# EAGLE design RPi GPIO Expander (EAGLE 9.5.2)
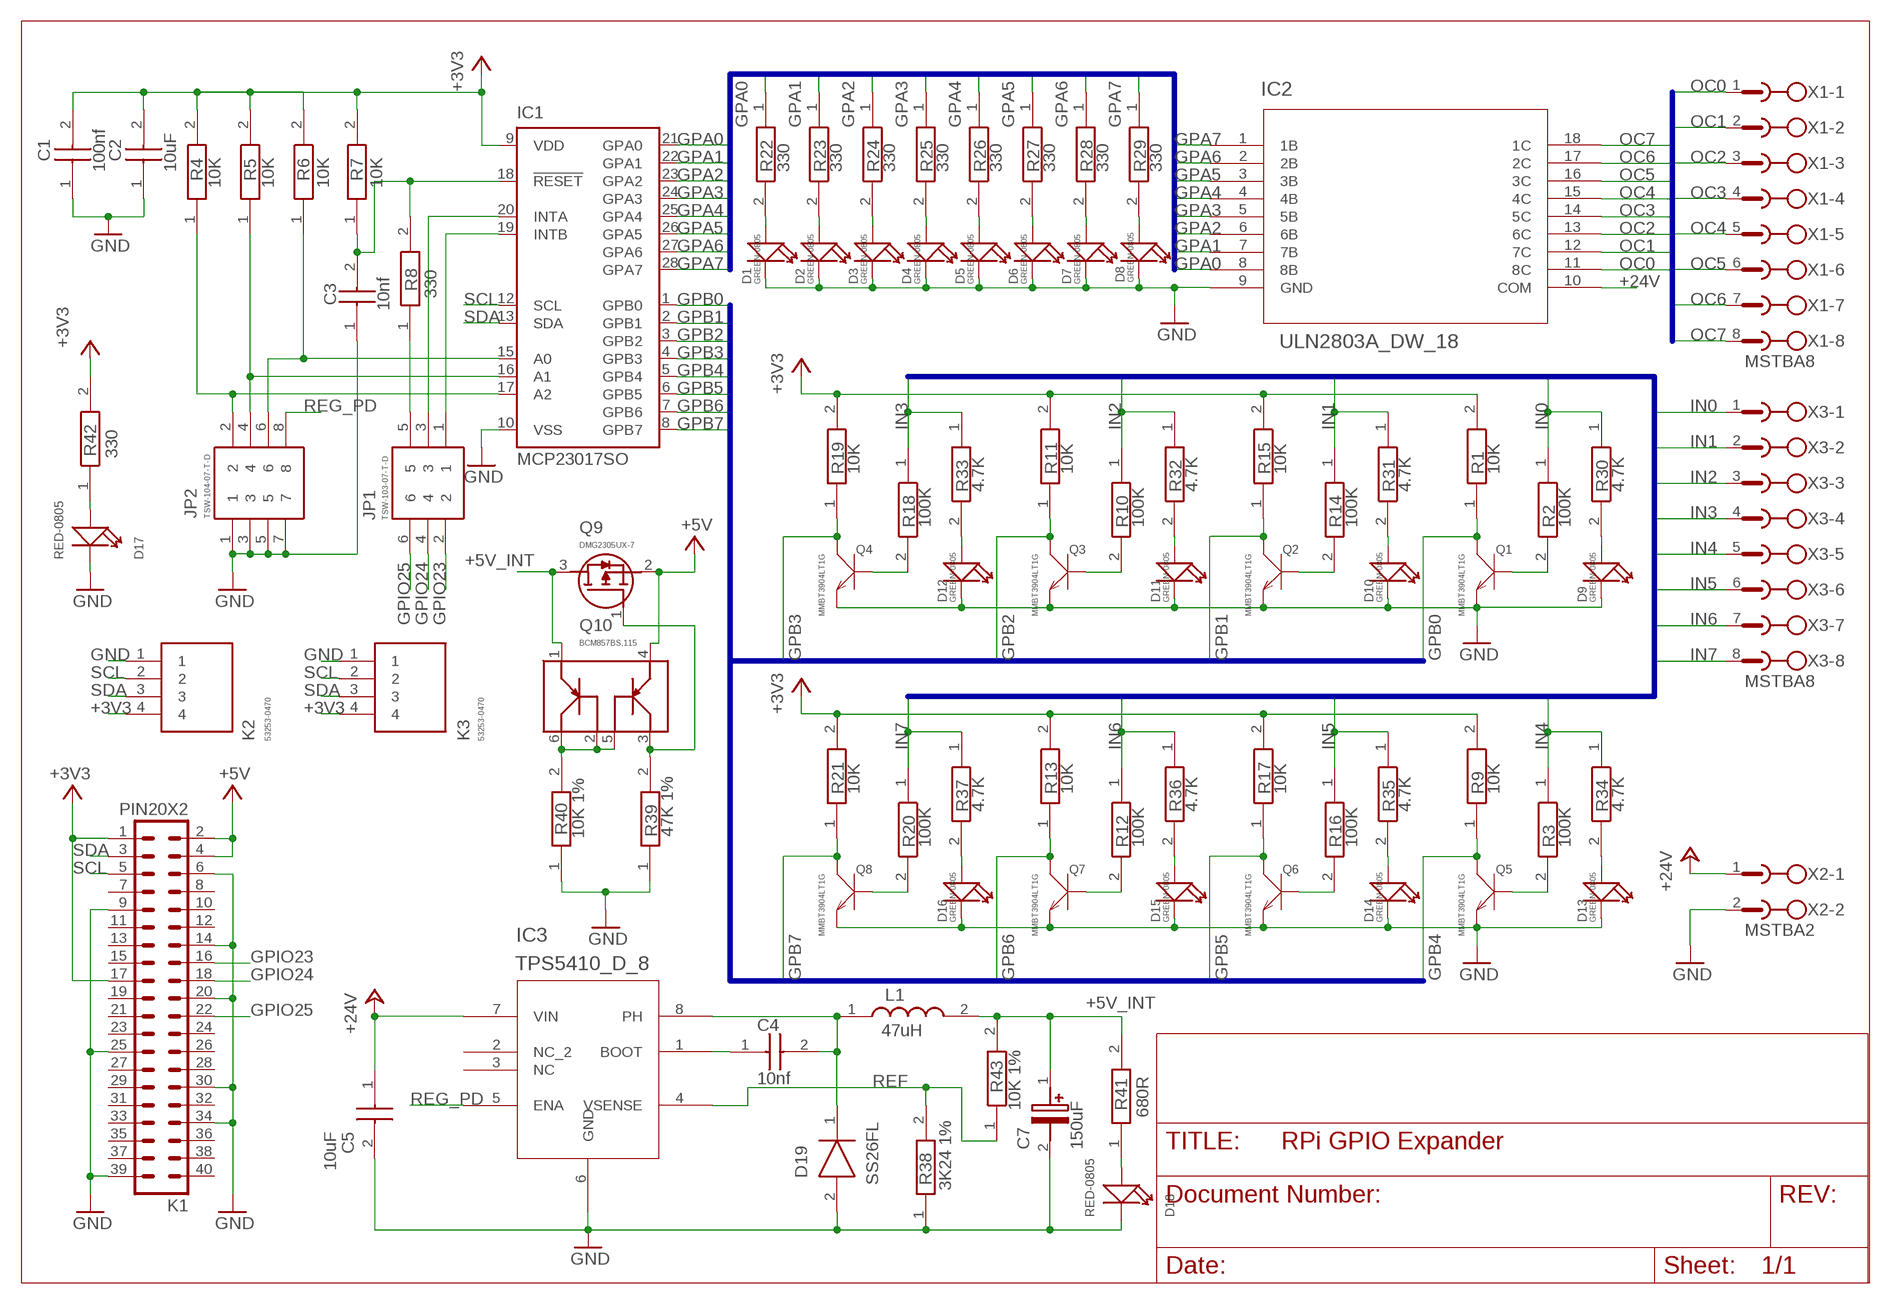
[diagram p0: schematic, sheet 1]

## Parts
C1  100nf  CC0805KRX7R9BB104  [CAPC2012X95N]
C2  10uF  CC0805ZKY5V6BB106  [CAPC2013X145N]
C3  10nf  CC0805KRX7R9BB103  [CAPC2012X135N]
C4  10nf  CC0805KRX7R9BB103  [CAPC2012X135N]
C5  10uF  C3225X7R1H106M250AC  [CAPC3225X230N]
C7  150uF  6TPG150M  [CAPPM3629X150N]
D1  GREEN-0805  SMD-LED-CLEAR-GREEN(0805)  [LED-0805]
D2  GREEN-0805  SMD-LED-CLEAR-GREEN(0805)  [LED-0805]
D3  GREEN-0805  SMD-LED-CLEAR-GREEN(0805)  [LED-0805]
D4  GREEN-0805  SMD-LED-CLEAR-GREEN(0805)  [LED-0805]
D5  GREEN-0805  SMD-LED-CLEAR-GREEN(0805)  [LED-0805]
D6  GREEN-0805  SMD-LED-CLEAR-GREEN(0805)  [LED-0805]
D7  GREEN-0805  SMD-LED-CLEAR-GREEN(0805)  [LED-0805]
D8  GREEN-0805  SMD-LED-CLEAR-GREEN(0805)  [LED-0805]
D9  GREEN-0805  SMD-LED-CLEAR-GREEN(0805)  [LED-0805]
D10  GREEN-0805  SMD-LED-CLEAR-GREEN(0805)  [LED-0805]
D11  GREEN-0805  SMD-LED-CLEAR-GREEN(0805)  [LED-0805]
D12  GREEN-0805  SMD-LED-CLEAR-GREEN(0805)  [LED-0805]
D13  GREEN-0805  SMD-LED-CLEAR-GREEN(0805)  [LED-0805]
D14  GREEN-0805  SMD-LED-CLEAR-GREEN(0805)  [LED-0805]
D15  GREEN-0805  SMD-LED-CLEAR-GREEN(0805)  [LED-0805]
D16  GREEN-0805  SMD-LED-CLEAR-GREEN(0805)  [LED-0805]
D17  RED-0805  SMD-LED-CLEAR-RED(0805)  [LED-0805]
D18  RED-0805  SMD-LED-CLEAR-RED(0805)  [LED-0805]
D19  SS26FL  [SODFL3617X108N]
IC1  MCP23017SO  [SO28W]
IC2  ULN2803A_DW_18  [DW18]
IC3  TPS5410_D_8  [D8]
JP1  TSW-103-07-T-D  [HDRV6W64P254_2X3_762X495X838P]
JP2  TSW-104-07-T-D  [HDRV8W64P254_2X4_1016X495X838P]
K1  PIN20X2  [PIN_20X2]
K2  53253-0470  [SHDR4W50P0X200_1X4_1000X365X55]
K3  53253-0470  [SHDR4W50P0X200_1X4_1000X365X55]
L1  47uH  CLF10060NIT-470M-D  [INDPM101100X630N]
Q1  MMBT3904LT1G  SMD-TRANSISTORS-NPN-40V-200MA-MMBT3904LT1G(SOT-23)  [SOT-23]
Q2  MMBT3904LT1G  SMD-TRANSISTORS-NPN-40V-200MA-MMBT3904LT1G(SOT-23)  [SOT-23]
Q3  MMBT3904LT1G  SMD-TRANSISTORS-NPN-40V-200MA-MMBT3904LT1G(SOT-23)  [SOT-23]
Q4  MMBT3904LT1G  SMD-TRANSISTORS-NPN-40V-200MA-MMBT3904LT1G(SOT-23)  [SOT-23]
Q5  MMBT3904LT1G  SMD-TRANSISTORS-NPN-40V-200MA-MMBT3904LT1G(SOT-23)  [SOT-23]
Q6  MMBT3904LT1G  SMD-TRANSISTORS-NPN-40V-200MA-MMBT3904LT1G(SOT-23)  [SOT-23]
Q7  MMBT3904LT1G  SMD-TRANSISTORS-NPN-40V-200MA-MMBT3904LT1G(SOT-23)  [SOT-23]
Q8  MMBT3904LT1G  SMD-TRANSISTORS-NPN-40V-200MA-MMBT3904LT1G(SOT-23)  [SOT-23]
Q9  DMG2305UX-7  [SOT96P240X100-3N]
Q10  BCM857BS,115  [SOT65P210X110-6N]
R1  10K  RC0805JR-0710KL  [RESC2012X60N]
R2  100K  RC0805JR-07100KL  [RESC2012X60N]
R3  100K  RC0805JR-07100KL  [RESC2012X60N]
R4  10K  RC0805JR-0710KL  [RESC2012X60N]
R5  10K  RC0805JR-0710KL  [RESC2012X60N]
R6  10K  RC0805JR-0710KL  [RESC2012X60N]
R7  10K  RC0805JR-0710KL  [RESC2012X60N]
R8  330  RC0805JR-07330RL  [RESC2012X60N]
R9  10K  RC0805JR-0710KL  [RESC2012X60N]
R10  100K  RC0805JR-07100KL  [RESC2012X60N]
R11  10K  RC0805JR-0710KL  [RESC2012X60N]
R12  100K  RC0805JR-07100KL  [RESC2012X60N]
R13  10K  RC0805JR-0710KL  [RESC2012X60N]
R14  100K  RC0805JR-07100KL  [RESC2012X60N]
R15  10K  RC0805JR-0710KL  [RESC2012X60N]
R16  100K  RC0805JR-07100KL  [RESC2012X60N]
R17  10K  RC0805JR-0710KL  [RESC2012X60N]
R18  100K  RC0805JR-07100KL  [RESC2012X60N]
R19  10K  RC0805JR-0710KL  [RESC2012X60N]
R20  100K  RC0805JR-07100KL  [RESC2012X60N]
R21  10K  RC0805JR-0710KL  [RESC2012X60N]
R22  330  RC0805JR-07330RL  [RESC2012X60N]
R23  330  RC0805JR-07330RL  [RESC2012X60N]
R24  330  RC0805JR-07330RL  [RESC2012X60N]
R25  330  RC0805JR-07330RL  [RESC2012X60N]
R26  330  RC0805JR-07330RL  [RESC2012X60N]
R27  330  RC0805JR-07330RL  [RESC2012X60N]
R28  330  RC0805JR-07330RL  [RESC2012X60N]
R29  330  RC0805JR-07330RL  [RESC2012X60N]
R30  4.7K  RC0805JR-074K7L  [RESC2012X60N]
R31  4.7K  RC0805JR-074K7L  [RESC2012X60N]
R32  4.7K  RC0805JR-074K7L  [RESC2012X60N]
R33  4.7K  RC0805JR-074K7L  [RESC2012X60N]
R34  4.7K  RC0805JR-074K7L  [RESC2012X60N]
R35  4.7K  RC0805JR-074K7L  [RESC2012X60N]
R36  4.7K  RC0805JR-074K7L  [RESC2012X60N]
R37  4.7K  RC0805JR-074K7L  [RESC2012X60N]
R38  3K24 1%  RC0805FR-073K24L  [RESC2012X60N]
R39  47K 1%  RC0805FR-0747KL  [RESC2012X60N]
R40  10K 1%  RC0805FR-0710KL  [RESC2012X60N]
R41  680R  RC0805JR-07680RL  [RESC2012X60N]
R42  330  RC0805JR-07330RL  [RESC2012X60N]
R43  10K 1%  RC0805FR-0710KL  [RESC2012X60N]
X1  MSTBA8  [MSTBA8]
X2  MSTBA2  [MSTBA2]
X3  MSTBA8  [MSTBA8]

## Nets
+3V3: C1.2 C2.2(C2) IC1.9(VDD) K1.1 K1.17 K2.4 K3.4 R1.2 R4.2 R5.2 R6.2 R7.2 R9.2 R11.2 R13.2 R15.2 R17.2 R19.2 R21.2 R42.2
+5V: K1.2 K1.4 Q9.2(S) Q10.4
+5V_INT: C7.1(+) L1.2 Q9.3(D) Q10.1 R41.2 R43.2
+24V: C5.1 IC2.10(COM) IC3.7(VIN) X2.1
GND: C1.1 C2.1(C1) C3.1 C5.2 C7.2(-) D1.- D2.- D3.- D4.- D5.- D6.- D7.- D8.- D9.- D10.- D11.- D12.- D13.- D14.- D15.- D16.- D17.- D18.- D19.2(A) IC1.10(VSS) IC2.9(GND) IC3.6(GND) JP2.1 JP2.3 JP2.5 JP2.7 K1.6 K1.9 K1.14 K1.20 K1.25 K1.30 K1.34 K1.39 K2.1 K3.1 Q1.2(E) Q2.2(E) Q3.2(E) Q4.2(E) Q5.2(E) Q6.2(E) Q7.2(E) Q8.2(E) R38.1 R39.1 R40.1 X2.2
GPA0: IC1.21(GPA0) IC2.8(8B) R22.1
GPA1: IC1.22(GPA1) IC2.7(7B) R23.1
GPA2: IC1.23(GPA2) IC2.6(6B) R24.1
GPA3: IC1.24(GPA3) IC2.5(5B) R25.1
GPA4: IC1.25(GPA4) IC2.4(4B) R26.1
GPA5: IC1.26(GPA5) IC2.3(3B) R27.1
GPA6: IC1.27(GPA6) IC2.2(2B) R28.1
GPA7: IC1.28(GPA7) IC2.1(1B) R29.1
GPB0: IC1.1(GPB0) Q1.3(C) R1.1
GPB1: IC1.2(GPB1) Q2.3(C) R15.1
GPB2: IC1.3(GPB2) Q3.3(C) R11.1
GPB3: IC1.4(GPB3) Q4.3(C) R19.1
GPB4: IC1.5(GPB4) Q5.3(C) R9.1
GPB5: IC1.6(GPB5) Q6.3(C) R17.1
GPB6: IC1.7(GPB6) Q7.3(C) R13.1
GPB7: IC1.8(GPB7) Q8.3(C) R21.1
GPIO23: JP1.2 K1.16
GPIO24: JP1.4 K1.18
GPIO25: JP1.6 K1.22
IN0: R2.1 R30.1 X3.1
IN1: R14.1 R31.1 X3.2
IN2: R10.1 R32.1 X3.3
IN3: R18.1 R33.1 X3.4
IN4: R3.1 R34.1 X3.5
IN5: R16.1 R35.1 X3.6
IN6: R12.1 R36.1 X3.7
IN7: R20.1 R37.1 X3.8
N$1: D12.+ R33.2
N$2: D1.+ R22.2
N$3: Q1.1(B) R2.2
N$4: IC1.19(INTB) JP1.1
N$5: JP1.5 R8.1
N$6: D2.+ R23.2
N$7: D3.+ R24.2
N$8: D4.+ R25.2
N$9: D5.+ R26.2
N$10: D6.+ R27.2
N$11: D7.+ R28.2
N$12: IC1.15(A0) JP2.6 R6.1
N$13: IC1.16(A1) JP2.4 R5.1
N$14: IC1.17(A2) JP2.2 R4.1
N$15: C3.2 IC1.18(!RESET) R7.1 R8.2
N$16: IC1.20(INTA) JP1.3
N$17: D11.+ R32.2
N$18: Q5.1(B) R3.2
N$19: D10.+ R31.2
N$20: Q3.1(B) R10.2
N$21: D9.+ R30.2
N$22: Q7.1(B) R12.2
N$23: D13.+ R34.2
N$24: Q2.1(B) R14.2
N$25: D14.+ R35.2
N$26: Q6.1(B) R16.2
N$27: D15.+ R36.2
N$28: Q4.1(B) R18.2
N$29: D16.+ R37.2
N$30: Q8.1(B) R20.2
N$31: D8.+ R29.2
N$32: Q10.2 Q10.5 Q10.6 R40.2
N$33: C4.2 D19.1(K) IC3.8(PH) L1.1
N$34: D18.+ R41.1
N$35: C4.1 IC3.1(BOOT)
N$36: D17.+ R42.1
N$38: Q9.1(G) Q10.3 R39.2
OC0: IC2.11(8C) X1.1
OC1: IC2.12(7C) X1.2
OC2: IC2.13(6C) X1.3
OC3: IC2.14(5C) X1.4
OC4: IC2.15(4C) X1.5
OC5: IC2.16(3C) X1.6
OC6: IC2.17(2C) X1.7
OC7: IC2.18(1C) X1.8
REF: IC3.4(VSENSE) R38.2 R43.1
REG_PD: IC3.5(ENA) JP2.8
SCL: IC1.12(SCL) K1.5 K2.2 K3.2
SDA: IC1.13(SDA) K1.3 K2.3 K3.3
Unconnected: IC3.2(NC_2) IC3.3(NC) K1.7 K1.8 K1.10 K1.11 K1.12 K1.13 K1.15 K1.19 K1.21 K1.23 K1.24 K1.26 K1.27 K1.28 K1.29 K1.31 K1.32 K1.33 K1.35 K1.36 K1.37 K1.38 K1.40

## Buses
GPA:GPA[0..7]
GPB:GPB[0..7]
IN:IN[0..7]
OC:OC[0..7]

## Library data of the parts
C1 = SamacSys_Parts:CC0805KRX7R9BB104: SURFACE-MOUNT CERAMIC MULTILAYER CAPACITORS Source: Datasheet <https://componentsearchengine.com/Datasheets/1/CC0805KRX7R9BB104.pdf>; DESCRIPTION: SURFACE-MOUNT CERAMIC MULTILAYER CAPACITORS; DIELECTRIC: X7R; HEIGHT: 0.95mm; MANUFACTURER_NAME: YAGEO (PHYCOMP); MANUFACTURER_PART_NUMBER: CC0805KRX7R9BB104; MOUSER_PART_NUMBER: 603-CC805KRX7R9BB104; MOUSER_PRICE-STOCK: https://www.mouser.com/Search/Refine.aspx?Keyword=603-CC805KRX7R9BB104
C2 = SamacSys_Parts:CC0805ZKY5V6BB106: CAPACITOR, 0805 10uF -20% to +80% 10V Source: Datasheet <https://componentsearchengine.com/Datasheets/1/CC0805ZKY5V6BB106.pdf>; DESCRIPTION: CAPACITOR, 0805 10uF -20% to +80% 10V; HEIGHT: mm; MANUFACTURER_NAME: YAGEO (PHYCOMP); MANUFACTURER_PART_NUMBER: CC0805ZKY5V6BB106; MOUSER_PART_NUMBER: 603-CC805ZKY5V6BB106; MOUSER_PRICE-STOCK: https://www.mouser.com/Search/Refine.aspx?Keyword=603-CC805ZKY5V6BB106
C3 C4 = SamacSys_Parts:CC0805KRX7R9BB103: 0805 X7R ceramic cap,10nF 50V Phycomp 10nF Multilayer Ceramic Capacitor (MLCC) 50 V dc +/-10% X7R dielectric Standard max op. temp. +125C Source: Datasheet <https://componentsearchengine.com/Datasheets/1/CC0805KRX7R9BB103.pdf>; DESCRIPTION: 0805 X7R ceramic cap,10nF 50V Phycomp 10nF Multilayer Ceramic Capacitor (MLCC) 50 V dc +/-10% X7R dielectric Standard max op. temp. +125C; HEIGHT: 1.35mm; MANUFACTURER_NAME: YAGEO (PHYCOMP); MANUFACTURER_PART_NUMBER: CC0805KRX7R9BB103; MOUSER_PART_NUMBER: 603-CC805KRX7R9BB103; MOUSER_PRICE-STOCK: https://www.mouser.com/Search/Refine.aspx?Keyword=603-CC805KRX7R9BB103
C5 = SamacSys_Parts:C3225X7R1H106M250AC: TDK 1210 C 10uF Ceramic Multilayer Capacitor, 50 V dc, +125C, X7R Dielectric, +/-20% Source: Datasheet <https://componentsearchengine.com/Datasheets/1/C3225X7R1H106M250AC.pdf>; DESCRIPTION: TDK 1210 C 10uF Ceramic Multilayer Capacitor, 50 V dc, +125C, X7R Dielectric, +/-20%; HEIGHT: 2.3mm; MANUFACTURER_NAME: TDK; MANUFACTURER_PART_NUMBER: C3225X7R1H106M250AC; MOUSER_PART_NUMBER: 810-C3225X7R1H106MAC; MOUSER_PRICE-STOCK: https://www.mouser.com/Search/Refine.aspx?Keyword=810-C3225X7R1H106MAC
C7 = SamacSys_Parts:6TPG150M: Panasonic 150uF SMD Solid Polymer Tantalum Capacitor, 6.3 V dc +/-20%, POSCAP Series Source: Datasheet <https://componentsearchengine.com/Datasheets/1/6TPG150M.pdf>; DESCRIPTION: Panasonic 150uF SMD Solid Polymer Tantalum Capacitor, 6.3 V dc +/-20%, POSCAP Series; HEIGHT: 1.5mm; MANUFACTURER_NAME: Panasonic; MANUFACTURER_PART_NUMBER: 6TPG150M; MOUSER_PART_NUMBER: 667-6TPG150M; MOUSER_PRICE-STOCK: https://www.mouser.com/Search/Refine.aspx?Keyword=667-6TPG150M
D1-D16 = OPL_Optoelectronics:SMD-LED-CLEAR-GREEN(0805): 304090057; MPN: 17-215SYGC/S530-E2/TR8
D17 D18 = OPL_Optoelectronics:SMD-LED-CLEAR-RED(0805): 304090046; MPN: 17-215SURC/S530-A2/TR8
D19 = SamacSys_Parts:SS26FL: ON Semi 60V 2A, Diode, 2-Pin SOD-123F SS26FL Source: Datasheet <https://componentsearchengine.com/Datasheets/1/SS26FL.pdf>; DESCRIPTION: ON Semi 60V 2A, Diode, 2-Pin SOD-123F SS26FL; HEIGHT: 1.08mm; MANUFACTURER_NAME: ON Semiconductor; MANUFACTURER_PART_NUMBER: SS26FL; MOUSER_PART_NUMBER: 512-SS26FL; MOUSER_PRICE-STOCK: https://www.mouser.com/Search/Refine.aspx?Keyword=512-SS26FL
IC1 = microchip:MCP23017: http://ww1.microchip.com/downloads/en/DeviceDoc/21952a.pdf Source: http://ww1.microchip.com/downloads/en/DeviceDoc/21952a.pdf; MF: MICROCHIP; MPN: MCP23017-E/SO; OC_FARNELL: 1332087; OC_NEWARK: 31K2958
IC2 = JP:ULN2803A_DW_18; DATASHEETURL: httpwww.ti.comlitgpnULN2803A; FAMILY_NAME: PERIPHERAL DRIVER AND ACTUATOR; GENERIC_PART_NUMBER: ULN2803A; INDUSTRY_STD_PKG_TYPE: SOIC; MANUFACTURER: Texas Instruments; PACKAGE_DESIGNATOR: DW; PIN_COUNT: 18
IC3 = JP:TPS5410_D_8; DATASHEETURL: httpwww.ti.comlitgpnTPS5410; FAMILY_NAME: STEPDOWN REGULATOR; GENERIC_PART_NUMBER: TPS5410; INDUSTRY_STD_PKG_TYPE: SOIC; MANUFACTURER: Texas Instruments; MANUFACTURER_PART_NUMBER: tps5410_d_8; PACKAGE_DESIGNATOR: D; PIN_COUNT: 8; VENDOR: Texas Instruments
JP1 = SamacSys_Parts:TSW-103-07-T-D: Samtec TSW, 2.54mm Pitch, 6 Way, 2 Row, Straight Pin Header, Through Hole Source: Datasheet <https://componentsearchengine.com/Datasheets/1/TSW-103-07-T-D.pdf>; DESCRIPTION: Samtec TSW, 2.54mm Pitch, 6 Way, 2 Row, Straight Pin Header, Through Hole; HEIGHT: 8.38mm; MANUFACTURER_NAME: SAMTEC; MANUFACTURER_PART_NUMBER: TSW-103-07-T-D; MOUSER_PART_NUMBER: 200-TSW10307TD; MOUSER_PRICE-STOCK: https://www.mouser.com/Search/Refine.aspx?Keyword=200-TSW10307TD
JP2 = SamacSys_Parts:TSW-104-07-T-D: Samtec TSW, 2.54mm Pitch, 8 Way, 2 Row PCB Terminal Block Header, Through Hole Source: Datasheet <https://componentsearchengine.com/Datasheets/1/TSW-104-07-T-D.pdf>; DESCRIPTION: Samtec TSW, 2.54mm Pitch, 8 Way, 2 Row PCB Terminal Block Header, Through Hole; HEIGHT: 8.38mm; MANUFACTURER_NAME: SAMTEC; MANUFACTURER_PART_NUMBER: TSW-104-07-T-D; MOUSER_PART_NUMBER: 200-TSW10407TD; MOUSER_PRICE-STOCK: https://www.mouser.com/Search/Refine.aspx?Keyword=200-TSW10407TD
K1 = FLYFISH:PIN20X2
K2 K3 = SamacSys_Parts:53253-0470: Header,MicroLatch,2.0mm,vertical,4way Molex MICRO-LATCH Series, Series Number 53253, 2mm Pitch 4 Way 1 Row Shrouded Straight PCB Header, Through Hole Source: Datasheet <https://componentsearchengine.com/Datasheets/1/53253-0470.pdf>; DESCRIPTION: Header,MicroLatch,2.0mm,vertical,4way Molex MICRO-LATCH Series, Series Number 53253, 2mm Pitch 4 Way 1 Row Shrouded Straight PCB Header, Through Hole; HEIGHT: 5.5mm; MANUFACTURER_NAME: Molex; MANUFACTURER_PART_NUMBER: 53253-0470; MOUSER_PART_NUMBER: 538-53253-0470; MOUSER_PRICE-STOCK: https://www.mouser.com/Search/Refine.aspx?Keyword=538-53253-0470
L1 = SamacSys_Parts:CLF10060NIT-470M-D: TDK CLF-NI-D Series Shielded Wire-wound SMD Inductor with a Ferrite Core, 47 uH +/-20% Wire-Wound Source: Datasheet <https://componentsearchengine.com/Datasheets/1/CLF10060NIT-470M-D.pdf>; DESCRIPTION: TDK CLF-NI-D Series Shielded Wire-wound SMD Inductor with a Ferrite Core, 47 uH +/-20% Wire-Wound; HEIGHT: 6.3mm; MANUFACTURER_NAME: TDK; MANUFACTURER_PART_NUMBER: CLF10060NIT-470M-D; MOUSER_PART_NUMBER: 810-CLF10060NIT470MD; MOUSER_PRICE-STOCK: https://www.mouser.com/Search/Refine.aspx?Keyword=810-CLF10060NIT470MD
Q1-Q8 = OPL_Discrete_Semiconductor:SMD-TRANSISTORS-NPN-40V-200MA-MMBT3904LT1G(SOT-23): 305010013; MPN: MMBT3904LT1G
Q9 = SamacSys_Parts:DMG2305UX-7: MOSFET P-Ch 20V 5A Enhancement SOT23 Diodes Inc DMG2305UX-7 P-channel MOSFET Transistor, -3.3 A, -20 V, 3-Pin SOT-23 Source: Datasheet <https://componentsearchengine.com/Datasheets/1/DMG2305UX-7.pdf>; DESCRIPTION: MOSFET P-Ch 20V 5A Enhancement SOT23 Diodes Inc DMG2305UX-7 P-channel MOSFET Transistor, -3.3 A, -20 V, 3-Pin SOT-23; HEIGHT: 1mm; MANUFACTURER_NAME: Diodes Inc.; MANUFACTURER_PART_NUMBER: DMG2305UX-7; MOUSER_PART_NUMBER: 621-DMG2305UX-7; MOUSER_PRICE-STOCK: https://www.mouser.com/Search/Refine.aspx?Keyword=621-DMG2305UX-7
Q10 = SamacSys_Parts:BCM857BS,115: Nexperia BCM857BS,115 Dual PNP Transistor, 100 mA, 45 V, 6-Pin UMT Source: Datasheet <https://componentsearchengine.com/Datasheets/1/BCM857BS,115.pdf>; DESCRIPTION: Nexperia BCM857BS,115 Dual PNP Transistor, 100 mA, 45 V, 6-Pin UMT; HEIGHT: 1.1mm; MANUFACTURER_NAME: Nexperia; MANUFACTURER_PART_NUMBER: BCM857BS,115; MOUSER_PART_NUMBER: 771-BCM857BS115; MOUSER_PRICE-STOCK: https://www.mouser.com/Search/Refine.aspx?Keyword=771-BCM857BS115
R1 R4-R7 R9 R11 R13 R15 R17 R19 R21 = SamacSys_Parts:RC0805JR-0710KL: YAGEO - RC0805JR-0710KL - SMD Chip Resistor, 0805 [2012 Metric], 10 kohm, RC Series, 150 V, Thick Film, 125 mW Source: Datasheet <https://componentsearchengine.com/Datasheets/1/RC0805JR-0710KL.pdf>; DESCRIPTION: YAGEO - RC0805JR-0710KL - SMD Chip Resistor, 0805 [2012 Metric], 10 kohm, RC Series, 150 V, Thick Film, 125 mW; HEIGHT: 0.6mm; MANUFACTURER_NAME: YAGEO (PHYCOMP); MANUFACTURER_PART_NUMBER: RC0805JR-0710KL; MOUSER_PART_NUMBER: 603-RC0805JR-0710KL; MOUSER_PRICE-STOCK: https://www.mouser.com/Search/Refine.aspx?Keyword=603-RC0805JR-0710KL
R2 R3 R10 R12 R14 R16 R18 R20 = SamacSys_Parts:RC0805JR-07100KL: RESISTOR, 0805 100K Ohms +/-5% 1/8 W Source: Datasheet <https://componentsearchengine.com/Datasheets/1/RC0805JR-07100KL.pdf>; DESCRIPTION: RESISTOR, 0805 100K Ohms +/-5% 1/8 W; HEIGHT: 0.6mm; MANUFACTURER_NAME: YAGEO (PHYCOMP); MANUFACTURER_PART_NUMBER: RC0805JR-07100KL; MOUSER_PART_NUMBER: 603-RC0805JR-07100KL; MOUSER_PRICE-STOCK: https://www.mouser.com/Search/Refine.aspx?Keyword=603-RC0805JR-07100KL
R8 R22-R29 R42 = SamacSys_Parts:RC0805JR-07330RL: Thick Film Resistors - SMD 330 OHM 5% Source: Datasheet <https://componentsearchengine.com/Datasheets/1/RC0805JR-07330RL.pdf>; DESCRIPTION: Thick Film Resistors - SMD 330 OHM 5%; HEIGHT: 0.6mm; MANUFACTURER_NAME: YAGEO (PHYCOMP); MANUFACTURER_PART_NUMBER: RC0805JR-07330RL; MOUSER_PART_NUMBER: 603-RC0805JR-07330RL; MOUSER_PRICE-STOCK: https://www.mouser.com/Search/Refine.aspx?Keyword=603-RC0805JR-07330RL
R30-R37 = SamacSys_Parts:RC0805JR-074K7L: RESISTOR, 0805 4.7K Ohms +/-5% 1/8 W Source: Datasheet <https://componentsearchengine.com/Datasheets/1/RC0805JR-074K7L.pdf>; DESCRIPTION: RESISTOR, 0805 4.7K Ohms +/-5% 1/8 W; HEIGHT: 0.6mm; MANUFACTURER_NAME: YAGEO (PHYCOMP); MANUFACTURER_PART_NUMBER: RC0805JR-074K7L; MOUSER_PART_NUMBER: 603-RC0805JR-074K7L; MOUSER_PRICE-STOCK: https://www.mouser.com/Search/Refine.aspx?Keyword=603-RC0805JR-074K7L
R38 = SamacSys_Parts:RC0805FR-073K24L: Thick Film Resistors - SMD 3.24K OHM 1% Source: Datasheet <https://componentsearchengine.com/Datasheets/1/RC0805FR-073K24L.pdf>; DESCRIPTION: Thick Film Resistors - SMD 3.24K OHM 1%; HEIGHT: 0.6mm; MANUFACTURER_NAME: YAGEO (PHYCOMP); MANUFACTURER_PART_NUMBER: RC0805FR-073K24L; MOUSER_PART_NUMBER: 603-RC0805FR-073K24L; MOUSER_PRICE-STOCK: http://www.mouser.com/Search/ProductDetail.aspx?qs=g6xwsc4j%252b%2foDAADmEdN98Q%3d%3d
R39 = SamacSys_Parts:RC0805FR-0747KL: Res SMD 0805 47K 1% 0.125W T.C.100ppm Yageo RC0805 Series Thick Film Surface Mount Resistor 805 Case 47k +/-1% 0.125W +/-100ppm/C Source: Datasheet <https://componentsearchengine.com/Datasheets/1/RC0805FR-0747KL.pdf>; DESCRIPTION: Res SMD 0805 47K 1% 0.125W T.C.100ppm Yageo RC0805 Series Thick Film Surface Mount Resistor 805 Case 47k +/-1% 0.125W +/-100ppm/C; HEIGHT: 0.6mm; MANUFACTURER_NAME: YAGEO (PHYCOMP); MANUFACTURER_PART_NUMBER: RC0805FR-0747KL; MOUSER_PART_NUMBER: 603-RC0805FR-0747KL; MOUSER_PRICE-STOCK: https://www.mouser.com/Search/Refine.aspx?Keyword=603-RC0805FR-0747KL
R40 R43 = SamacSys_Parts:RC0805FR-0710KL: GENERAL PURPOSE CHIP RESISTORS Source: Datasheet <https://componentsearchengine.com/Datasheets/1/RC0805FR-0710KL.pdf>; DESCRIPTION: GENERAL PURPOSE CHIP RESISTORS; HEIGHT: 0.6mm; MANUFACTURER_NAME: YAGEO (PHYCOMP); MANUFACTURER_PART_NUMBER: RC0805FR-0710KL; MOUSER_PART_NUMBER: 603-RC0805FR-0710KL; MOUSER_PRICE-STOCK: https://www.mouser.com/Search/Refine.aspx?Keyword=603-RC0805FR-0710KL
R41 = SamacSys_Parts:RC0805JR-07680RL: RESISTOR, 0805 680 Ohms +/-5% 1/8 W Source: Datasheet <https://componentsearchengine.com/Datasheets/1/RC0805JR-07680RL.pdf>; DESCRIPTION: RESISTOR, 0805 680 Ohms +/-5% 1/8 W; HEIGHT: 0.6mm; MANUFACTURER_NAME: YAGEO (PHYCOMP); MANUFACTURER_PART_NUMBER: RC0805JR-07680RL; MOUSER_PART_NUMBER: 603-RC0805JR-07680RL; MOUSER_PRICE-STOCK: https://www.mouser.com/Search/Refine.aspx?Keyword=603-RC0805JR-07680RL; SPICEPREFIX: R
X1 X3 = con-phoenix-508:MSTBA8: PHOENIX; MF: FARNELL; MPN: 1757307; OC_FARNELL: 3705225; OC_NEWARK: 71C4166
X2 = con-phoenix-508:MSTBA2: PHOENIX; MF: FARNELL; MPN: 1757242; OC_FARNELL: 3705171; OC_NEWARK: 71C4161

## Board
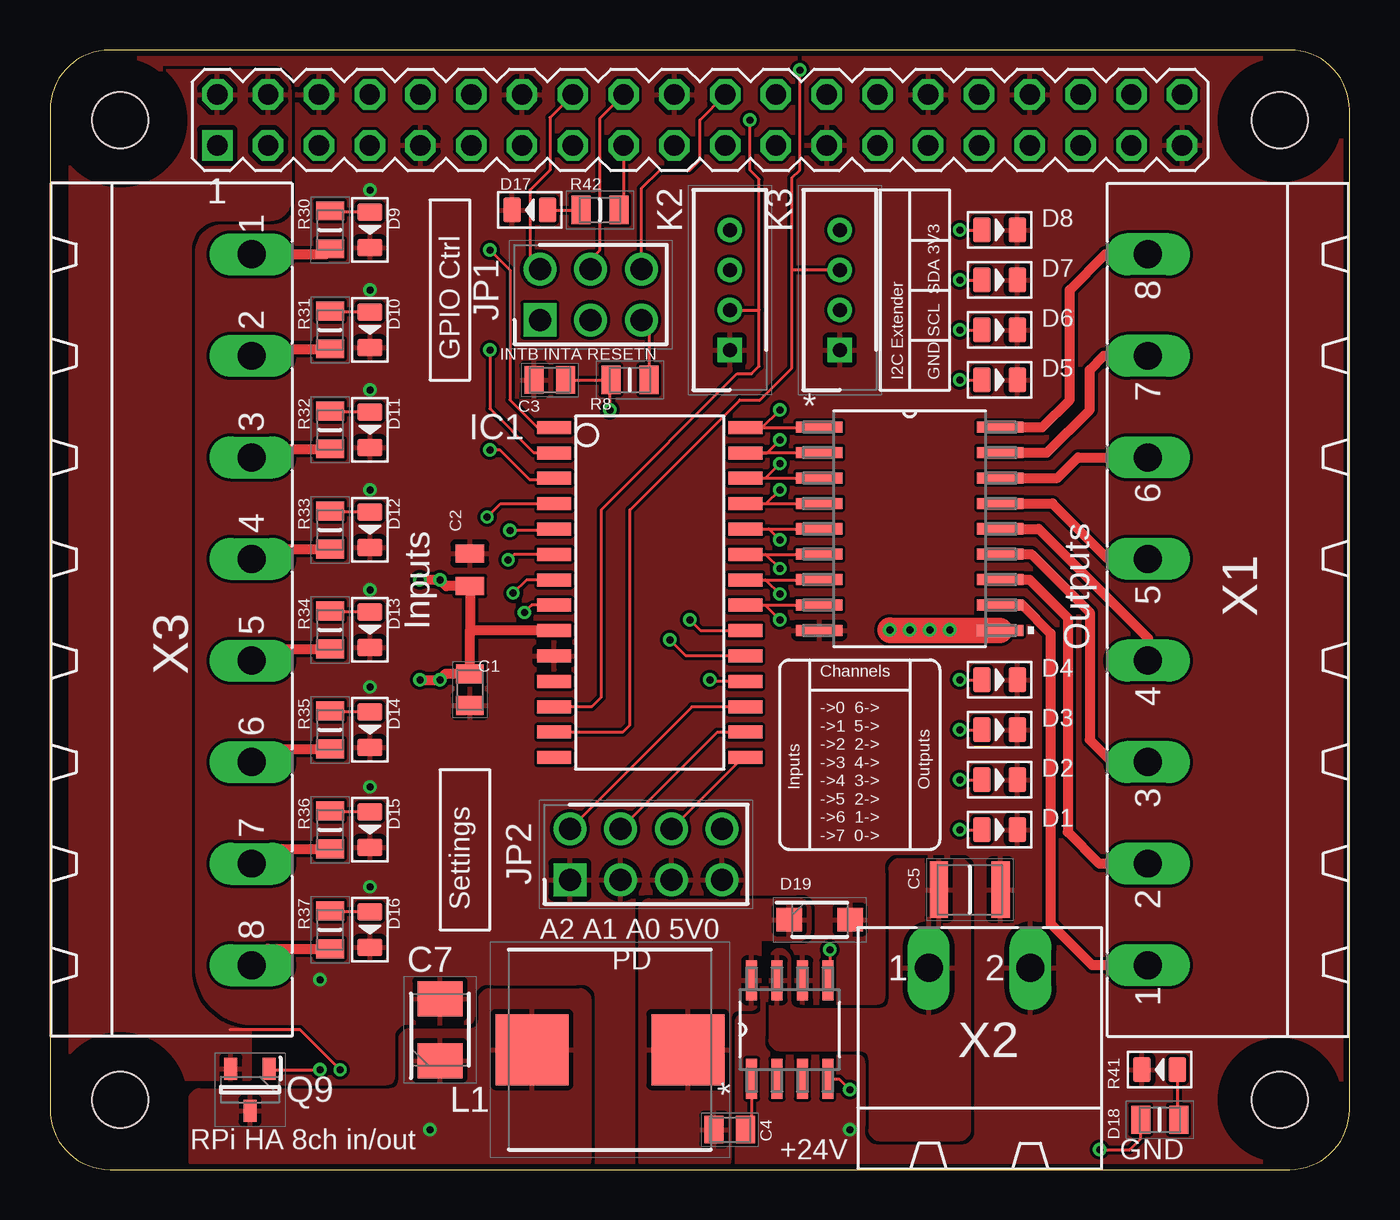
[diagram p1: board, top side]
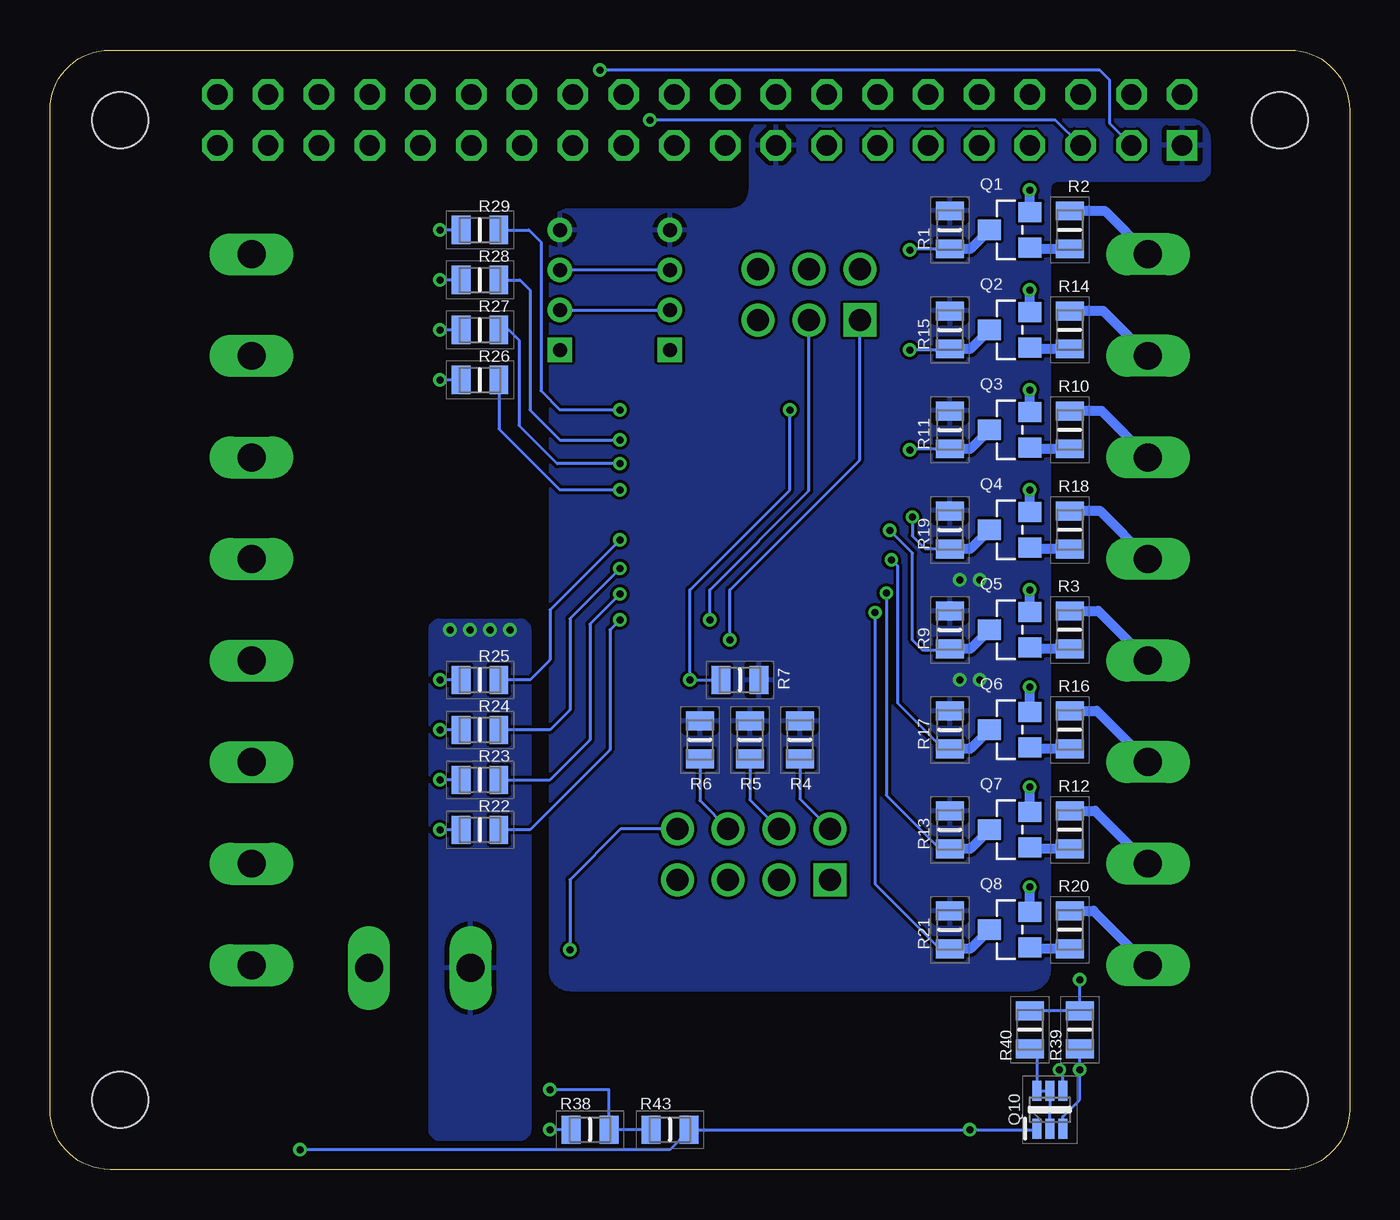
[diagram p2: board, bottom side, seen from below]

Size 65 x 56 mm. Coordinates in mm from the lower left corner, seen from the top.
Outline: 0,3 arc90 3,0 62,0 arc90 65,3 65,53 arc90 62,56 3,56 arc90 0,53 0,3
Copper layers (1*16): Top 0.035mm / dielectric 1.5mm / Bottom 0.035mm
Design rules "ITEADstudio_DRC *": minimum track width 6mil, minimum drill 12mil, track to track 6mil, track to pad 6mil, pad to pad 6mil, via to via 6mil, smd to smd 0mil, copper to edge 12mil, drill to drill 12mil, minimum pad ring 10mil, minimum via ring 6mil, stop-mask expansion 2mil, vias tented up to drill 100mil, thermal gap 10mil
Holes 2.8 mm at 3.5,3.5 3.5,52.5 61.5,52.5 61.5,3.5
tRestrict: area 1.9,51 to 5,54; area 60,51 to 63,54; area 60,1.9 to 63,5; area 1.9,1.9 to 5,5
bRestrict: area 1.9,1.9 to 5,5; area 1.9,51 to 5,54; area 60,1.9 to 63,5; area 60,51 to 63,54

### Footprints (pad centres in the part's own frame; a part is rotated, then mirrored left to right if it is on the bottom)
CAPC2012X95N = smd 0.96 x 1.39: 1 -0.79,0; 2 0.79,0
CAPC2013X145N = smd 0.914 x 1.448: 1 -0.813,0; 2 0.813,0
CAPC2012X135N = smd 0.96 x 1.39: 1 -0.79,0; 2 0.79,0
CAPC3225X230N = smd 0.92 x 2.82: 1 -1.54,0; 2 1.54,0
CAPPM3629X150N = smd 1.75 x 2.25: 1 -1.55,0; 2 1.55,0
LED-0805 = smd 0.889 x 1.27: + -0.889,0; - 0.889,0
SODFL3617X108N = smd 1.26 x 1.17: 1 -1.525,0; 2 1.525,0
SO28W = smd 0.65 x 1.7: 1 -7.62,-4.78; 2 -6.35,-4.78; 3 -5.08,-4.78; 4 -3.81,-4.78; 5 -2.54,-4.78; 6 -1.27,-4.78; 7 0,-4.78; 8 1.27,-4.78; 9 2.54,-4.78; 10 3.81,-4.78; 11 5.08,-4.78; 12 6.35,-4.78; 13 7.62,-4.78; 14 8.89,-4.78; 15 8.89,4.78; 16 7.62,4.78; 17 6.35,4.78; 18 5.08,4.78; 19 3.81,4.78; 20 2.54,4.78; 21 1.27,4.78; 22 0,4.78; 23 -1.27,4.78; 24 -2.54,4.78; 25 -3.81,4.78; 26 -5.08,4.78; 27 -6.35,4.78; 28 -7.62,4.78
DW18 = smd 2.311 x 0.559: 1 -4.521,5.08; 2 -4.521,3.81; 3 -4.521,2.54; 4 -4.521,1.27; 5 -4.521,0; 6 -4.521,-1.27; 7 -4.521,-2.54; 8 -4.521,-3.81; 9 -4.521,-5.08; 10 4.521,-5.08; 11 4.521,-3.81; 12 4.521,-2.54; 13 4.521,-1.27; 14 4.521,0; 15 4.521,1.27; 16 4.521,2.54; 17 4.521,3.81; 18 4.521,5.08
D8 = smd 1.981 x 0.559: 1 -2.464,1.905; 2 -2.464,0.635; 3 -2.464,-0.635; 4 -2.464,-1.905; 5 2.464,-1.905; 6 2.464,-0.635; 7 2.464,0.635; 8 2.464,1.905
HDRV6W64P254_2X3_762X495X838P = drill 1.1 pad 1.65 square: 1 0,0 | drill 1.1 pad 1.65: 2 0,2.54; 3 2.54,0; 4 2.54,2.54; 5 5.08,0; 6 5.08,2.54
HDRV8W64P254_2X4_1016X495X838P = drill 1.1 pad 1.65 square: 1 0,0 | drill 1.1 pad 1.65: 2 0,2.54; 3 2.54,0; 4 2.54,2.54; 5 5.08,0; 6 5.08,2.54; 7 7.62,0; 8 7.62,2.54
PIN_20X2 = drill 1.016 square: 1 -24.13,-1.27 | drill 1.016 octagon: 2 -24.13,1.27; 3 -21.59,-1.27; 4 -21.59,1.27; 5 -19.05,-1.27; 6 -19.05,1.27; 7 -16.51,-1.27; 8 -16.51,1.27; 9 -13.97,-1.27; 10 -13.97,1.27; 11 -11.43,-1.27; 12 -11.43,1.27; 13 -8.89,-1.27; 14 -8.89,1.27; 15 -6.35,-1.27; 16 -6.35,1.27; 17 -3.81,-1.27; 18 -3.81,1.27; 19 -1.27,-1.27; 20 -1.27,1.27; 21 1.27,-1.27; 22 1.27,1.27; 23 3.81,-1.27; 24 3.81,1.27; 25 6.35,-1.27; 26 6.35,1.27; 27 8.89,-1.27; 28 8.89,1.27; 29 11.43,-1.27; 30 11.43,1.27; 31 13.97,-1.27; 32 13.97,1.27; 33 16.51,-1.27; 34 16.51,1.27; 35 19.05,-1.27; 36 19.05,1.27; 37 21.59,-1.27; 38 21.59,1.27; 39 24.13,-1.27; 40 24.13,1.27
SHDR4W50P0X200_1X4_1000X365X55 = drill 0.7 pad 1.1 square: 1 0,0 | drill 0.7 pad 1.1: 2 2,0; 3 4,0; 4 6,0
INDPM101100X630N = smd 3.65 x 3.55: 1 -3.9,0; 2 3.9,0
SOT-23 = smd 1.016 x 1.143: 1 -0.889,-1.016; 2 0.889,-1.016; 3 0,1.016
SOT96P240X100-3N = smd 1.1 x 0.65: 1 -1.05,0.96; 2 -1.05,-0.96; 3 1.05,0
SOT65P210X110-6N = smd 1 x 0.45: 1 -0.95,0.65; 2 -0.95,0; 3 -0.95,-0.65; 4 0.95,-0.65; 5 0.95,0; 6 0.95,0.65
RESC2012X60N = smd 0.95 x 1.4: 1 -0.95,0; 2 0.95,0
MSTBA8 = drill 1.397 long: 1 -17.78,5.08; 2 -12.7,5.08; 3 -7.62,5.08; 4 -2.54,5.08; 5 2.54,5.08; 6 7.62,5.08; 7 12.7,5.08; 8 17.78,5.08
MSTBA2 = drill 1.397 long: 1 -2.54,5.08; 2 2.54,5.08

### Placement (x,y rotation side)
C1  21,24 90 top
C2  21,30 270 top
C3  25,39.5 0 top
C4  34,2 180 top
C5  46,14 0 top
C7  19.5,7 90 top
D1  47.5,17 0 top
D2  47.5,19.5 0 top
D3  47.5,22 0 top
D4  47.5,24.5 0 top
D5  47.5,39.5 0 top
D6  47.5,42 0 top
D7  47.5,44.5 0 top
D8  47.5,47 0 top
D9  16,47 270 top
D10  16,42 270 top
D11  16,37 270 top
D12  16,32 270 top
D13  16,27 270 top
D14  16,22 270 top
D15  16,17 270 top
D16  16,12 270 top
D17  24,48 180 top
D18  55.5,5 180 top
D19  38.5,12.5 0 top
IC1  30,29.5 270 top
IC2  43,32.05 0 top
IC3  37,7 90 top
JP1  24.5,42.5 0 top
JP2  26,14.5 0 top
K1  32.5,52.5 0 top
K2  34,41 90 top
K3  39.5,41 90 top
L1  28,6 180 top
Q1  17,47 90 bottom
Q2  17,42 90 bottom
Q3  17,37 90 bottom
Q4  17,32 90 bottom
Q5  17,27 90 bottom
Q6  17,22 90 bottom
Q7  17,17 90 bottom
Q8  17,12 90 bottom
Q9  10,4 270 top
Q10  15,3 90 bottom
R1  20,47 90 bottom
R2  14,47 270 bottom
R3  14,27 270 bottom
R4  27.5,21.5 90 bottom
R5  30,21.5 90 bottom
R6  32.5,21.5 90 bottom
R7  30.5,24.5 0 bottom
R8  29,39.5 180 top
R9  20,27 90 bottom
R10  14,37 270 bottom
R11  20,37 90 bottom
R12  14,17 270 bottom
R13  20,17 90 bottom
R14  14,42 270 bottom
R15  20,42 90 bottom
R16  14,22 270 bottom
R17  20,22 90 bottom
R18  14,32 270 bottom
R19  20,32 90 bottom
R20  14,12 270 bottom
R21  20,12 90 bottom
R22  43.5,17 180 bottom
R23  43.5,19.5 180 bottom
R24  43.5,22 180 bottom
R25  43.5,24.5 180 bottom
R26  43.5,39.5 180 bottom
R27  43.5,42 180 bottom
R28  43.5,44.5 180 bottom
R29  43.5,47 180 bottom
R30  14,47 90 top
R31  14,42 90 top
R32  14,37 90 top
R33  14,32 90 top
R34  14,27 90 top
R35  14,22 90 top
R36  14,17 90 top
R37  14,12 90 top
R38  38,2 0 bottom
R39  13.5,7 270 bottom
R40  16,7 270 bottom
R41  55.5,2.5 180 top
R42  27.5,48 0 top
R43  34,2 0 bottom
X1  60,28 90 top
X2  46.5,5 0 top
X3  5,28 270 top

### Tracks (layer width: path | path; a pad name or v marks a point on that pad's centre or on a via)
+3V3  (via drill 0.35)
  Top 0.152: K1.17 28.69,48.24 R42.2
  Top 0.508: IC1.9 21,26.96 | 21,26.96 C1.2 19.79,24.79 v19.5,24.5 v18.5,24.5 | 21,26.96 C2.2 19.81,29.19 v19.5,29.5 v18.5,29.5
  pour Bottom: 8.5,52.5 28,52.5 29,52.5 arc-90 30,51.5 30,49.5 30,49 arc90 31,48 39,48 arc-90 40,47 40,10 arc-90 39,9 16,9 arc-90 15,10 15,12 15,49 arc90 14.5,49.5 8.5,49.5 7.5,49.5 arc-90 7,50 7,51.5 arc-90 8,52.5
+5V  (via drill 0.35)
  Top 0.152: v14.51,4.99 12.5,7 9,7
  Bottom 0.152: Q10.4 14.35,4.82 v14.51,4.99
  pour Top (isolate 0.254): 2,55 11,55 arc-90 12,54 12,48.5 arc-90 11,47.5 8.5,47.5 arc90 7,46 7,10 arc90 10,7 10,4.5 1.5,4.5 arc-90 1,5 1,54 arc-90
+5V_INT  (via drill 0.35)
  Top 0.152: v52.5,1 54,1 54.55,1.55 R41.2
  Bottom 0.152: Q10.1 15.7,2 v19,2 R43.2 33.11,1.89 34,1 v52.5,1
  pour Top (isolate 0.254): 18,7 21,7 arc90 21.5,7.5 21.5,8.5 arc-90 22,9 26.5,9 arc-90 27,8.5 27,0.5 arc-90 26.5,0 7.5,0 arc-90 7,0.5 7,3.5 arc-90 7.5,4 17,4 arc90 17.5,4.5 17.5,6.5 arc-90
+24V  (via drill 0.35)
  Top 1.27: IC2.10 42.03,26.97 v42,27
  other vias: 43,27 44,27 45,27
  pour Top (isolate 0.254): 36,10.5 36,6.5 arc90 36.5,6 40.5,6 arc-90 41,5.5 41,2 arc90 41.5,1.5 45.5,1.5 arc90 46,2 46,15 arc90 45.5,15.5 42.5,15.5 arc90 42,15 42,8.5 arc-90 41.5,8 37.5,8 arc-90 37,8.5 37,10.5 arc90 36.5,11 arc90
  pour Bottom: 41.5,1.5 45.5,1.5 arc90 46,2 46,27 arc90 45.5,27.5 41.5,27.5 arc90 41,27 41,2 arc90
GND  (via drill 0.35)
  Bottom 0.152: R38.1 v40,2 | R40.1 R39.1 v13.5,9.5
  Bottom 0.508: Q1.2 16,47.91 v16,49 | Q2.2 15.98,43.98 v16,44 | Q3.2 15.98,38.98 v16,39 | Q4.2 15.98,33.98 v16,34 | Q5.2 15.98,28.98 v16,29 | Q6.2 15.98,23.98 16,24 v16,24.13 | Q7.2 15.98,18.98 16,19 v16,19.13 | Q8.2 15.98,13.98 16,14 v16,14.13
  pour Top (rank 2): 0,3 arc90 3,0 62,0 arc90 65,3 65,53 arc90 62,56 3,56 arc90 0,53
GPA0  (via drill 0.35)
  Top 0.152: IC2.8 IC1.21 35.77,28.23 v36.5,27.5
  Bottom 0.152: v36.5,27.5 37,27 37,21 41,17 R22.1
GPA1  (via drill 0.35)
  Top 0.152: IC2.7 IC1.22 35.79,29.5 v36.5,28.79
  Bottom 0.152: R23.1 40,19.5 38,21.5 38,27.29 v36.5,28.79
GPA2  (via drill 0.35)
  Top 0.152: IC2.6 IC1.23 35.79,30.77 v36.5,30.06
  Bottom 0.152: R24.1 40,22 39,23 39,27.56 v36.5,30.06
GPA3  (via drill 0.35)
  Top 0.152: IC2.5 IC1.24 35.96,32.04 v36.5,31.5
  Bottom 0.152: R25.1 41,24.5 40,25.5 40,28 v36.5,31.5
GPA4  (via drill 0.35)
  Top 0.152: IC2.4 IC1.25 35.81,33.31 v36.5,34
  Bottom 0.152: v36.5,34 39.5,34 42.55,37.05 R26.1
GPA5  (via drill 0.35)
  Top 0.152: IC2.3 IC1.26 35.78,34.58 v36.5,35.3
  Bottom 0.152: R27.1 42.05,42 41.55,41.5 41.55,37.22 39.63,35.3 v36.5,35.3
GPA6  (via drill 0.35)
  Top 0.152: IC2.2 IC1.27 35.85,35.85 v36.5,36.5
  Bottom 0.152: R28.1 41.5,44.5 41,44 41,38 39.5,36.5 v36.5,36.5
GPA7  (via drill 0.35)
  Top 0.152: IC2.1 IC1.28 35.62,37.12 v36.5,38
  Bottom 0.152: R29.1 41.05,47 40.45,46.4 40.45,38.95 39.5,38 v36.5,38
GPB0  (via drill 0.35)
  Top 0.152: v22,46 23,45 23,38.5 24.38,37.12 IC1.1
  Bottom 0.152: R1.1 22,46.05 22.05,46 v22,46
  Bottom 0.508: Q1.3 18.97,46.05 R1.1
GPB1  (via drill 0.35)
  Top 0.152: IC1.2 24.2,35.85 22,38.05 v22,41
  Bottom 0.152: R15.1 20.05,41 v22,41
  Bottom 0.508: Q2.3 18.97,41.05 R15.1
GPB2  (via drill 0.35)
  Top 0.152: IC1.3 25.14,34.5 24,34.5 22.5,36 v22,36
  Bottom 0.152: v22,36 21.95,36.05 R11.1
  Bottom 0.508: Q3.3 18.97,36.05 R11.1
GPB3  (via drill 0.35)
  Top 0.152: v21.86,32.63 22.54,33.31 IC1.4
  Bottom 0.152: R19.1 21.23,31.05 21.86,31.69 v21.86,32.63
  Bottom 0.508: Q4.3 18.97,31.05 R19.1
GPB4  (via drill 0.35)
  Top 0.152: IC1.5 25.16,31.98 v23,31.98
  Bottom 0.152: R9.1 20.05,26 21.36,26 21.86,26.49 21.86,30.83 v23,31.98
  Bottom 0.508: Q5.3 18.97,26.05 R9.1
GPB5  (via drill 0.35)
  Top 0.152: IC1.6 23.22,30.77 22.95,30.5 v22.92,30.5
  Bottom 0.152: v22.92,30.5 22.61,30.19 22.61,23.34 20.32,21.05 R17.1
  Bottom 0.508: Q6.3 18.97,21.05 R17.1
GPB6  (via drill 0.35)
  Top 0.152: IC1.7 23.84,29.5 v23.17,28.83
  Bottom 0.152: v23.17,28.83 23.17,18.72 20.5,16.05 R13.1
  Bottom 0.508: Q7.3 18.97,16.05 R13.1
GPB7  (via drill 0.35)
  Top 0.152: IC1.8 24.09,28.23 v23.73,27.86
  Bottom 0.152: v23.73,27.86 23.73,14.28 20.5,11.05 R21.1
  Bottom 0.508: Q8.3 18.97,11.05 R21.1
GPIO23
  Top 0.152: K1.16 25,52.62 25,50 24,49 24,45.54 JP1.2
GPIO24
  Top 0.152: JP1.4 27.04,45.54 27.5,46 27.5,52.58 K1.18
GPIO25
  Top 0.152: JP1.6 29.58,49.08 30.5,50 32,50 32.5,50.5 32.5,52.5 K1.22
IN0
  Top 0.508: X3.1 13.78,45.78 14,46 14.05,46 R30.1
  Bottom 0.508: R2.1 12.25,47.95 X3.1
IN1
  Top 0.508: X3.2 10.43,41.05 R31.1
  Bottom 0.508: R14.1 12.33,42.95 X3.2
IN2
  Top 0.508: X3.3 10.51,36.05 R32.1
  Bottom 0.508: R10.1 12.41,37.95 X3.3
IN3
  Top 0.508: X3.4 10.59,31.05 R33.1
  Bottom 0.508: R18.1 12.49,32.95 X3.4
IN4
  Top 0.508: X3.5 10.67,26.05 R34.1
  Bottom 0.508: R3.1 12.57,27.95 X3.5
IN5
  Top 0.508: X3.6 10.75,21.05 R35.1
  Bottom 0.508: R16.1 12.65,22.95 X3.6
IN6
  Top 0.508: X3.7 10.83,16.05 R36.1
  Bottom 0.508: R12.1 12.73,17.95 X3.7
IN7
  Top 0.508: X3.8 10.91,11.05 R37.1
  Bottom 0.508: R20.1 12.81,12.95 X3.8
N$1
  Top 0.152: D12.+ 14.06,32.89 R33.2
N$2  (via drill 0.35)
  Top 0.152: v45.5,17 D1.+
  Bottom 0.152: R22.2 v45.5,17
N$3
  Bottom 0.508: R2.2 15.92,46.05 Q1.1
N$4  (via drill 0.35)
  Top 0.152: IC1.19 31.81,25.69 v31,26.5
  Bottom 0.152: v31,26.5 31,29 24.5,35.5 JP1.1
N$5
  Top 0.152: JP1.5 29.95,42.21 R8.1
N$6  (via drill 0.35)
  Top 0.152: v45.5,19.5 D2.+
  Bottom 0.152: R23.2 v45.5,19.5
N$7  (via drill 0.35)
  Top 0.152: v45.5,22 D3.+
  Bottom 0.152: R24.2 v45.5,22
N$8  (via drill 0.35)
  Top 0.152: v45.5,24.5 D4.+
  Bottom 0.152: R25.2 v45.5,24.5
N$9  (via drill 0.35)
  Top 0.152: v45.5,39.5 D5.+
  Bottom 0.152: R26.2 v45.5,39.5
N$10  (via drill 0.35)
  Top 0.152: v45.5,42 D6.+
  Bottom 0.152: R27.2 v45.5,42
N$11  (via drill 0.35)
  Top 0.152: v45.5,44.5 D7.+
  Bottom 0.152: R28.2 v45.5,44.5
N$12
  Top 0.152: IC1.15 34.65,20.61 JP2.6
  Bottom 0.152: R6.1 32.5,18.46 JP2.6
N$13
  Top 0.152: IC1.16 33.38,21.88 JP2.4
  Bottom 0.152: R5.1 30,18.5 JP2.4
N$14
  Top 0.152: IC1.17 32.11,23.15 JP2.2
  Bottom 0.152: R4.1 27.5,18.54 JP2.2
N$15  (via drill 0.35)
  Top 0.152: C3.2 28,39.5 | 28,39.5 R8.2 | IC1.18 33.08,24.42 v33,24.5 | v28,38 28,39.5
  Bottom 0.152: R7.1 v33,24.5 33,29 28,34 v28,38
N$16  (via drill 0.35)
  Top 0.152: v32,27.5 32.54,26.96 IC1.20
  Bottom 0.152: v32,27.5 32,29 27.04,33.96 JP1.3
N$17
  Top 0.152: D11.+ 14.06,37.89 R32.2
N$18
  Bottom 0.508: R3.2 15.92,26.05 Q5.1
N$19
  Top 0.152: D10.+ 14.06,42.89 R31.2
N$20
  Bottom 0.508: R10.2 15.92,36.05 Q3.1
N$21
  Top 0.152: D9.+ 14.06,47.89 R30.2
N$22
  Bottom 0.508: R12.2 15.92,16.05 Q7.1
N$23
  Top 0.152: D13.+ 14.06,27.89 R34.2
N$24
  Bottom 0.508: R14.2 15.92,41.05 Q2.1
N$25
  Top 0.152: D14.+ 14.06,22.89 R35.2
N$26
  Bottom 0.508: R16.2 15.92,21.05 Q6.1
N$27
  Top 0.152: D15.+ 14.06,17.89 R36.2
N$28
  Bottom 0.508: R18.2 15.92,31.05 Q4.1
N$29
  Top 0.152: D16.+ 14.06,12.89 R37.2
N$30
  Bottom 0.508: R20.2 15.92,11.05 Q8.1
N$31  (via drill 0.35)
  Top 0.152: v45.5,47 D8.+
  Bottom 0.152: R29.2 v45.5,47
N$32
  Bottom 0.152: R40.2 15.65,5.7 Q10.6 Q10.5 15,3 Q10.2
N$33
  pour Top: 29.5,6 29.5,12.5 29.5,13 arc-90 30,13.5 37.5,13.5 arc-90 38,13 38,12 arc-90 37.5,11.5 35.5,11.5 35.5,8.5 arc-90 35,8 34.5,8 arc90 34,7.5 34,0.5 arc-90 33.5,0 30,0 arc-90 29.5,0.5
N$34
  Top 0.152: D18.+ 56.39,2.56 R41.1
N$35
  Top 0.152: IC3.1 35.09,2.21 C4.1
N$36
  Top 0.152: D17.+ R42.1
N$38  (via drill 0.35)
  Top 0.152: Q9.1 11.01,5 v13.5,5
  Bottom 0.152: Q10.3 14.35,2.65 13.5,3.5 v13.5,5 13.5,6 R39.2
OC0
  Top 0.508: IC2.11 48.62,28.24 50.04,26.82 50.04,12.3 52.13,10.22 X1.1
OC1
  Top 0.508: IC2.12 48.99,29.51 50.91,27.59 50.91,16.89 52.49,15.3 X1.2
OC2
  Top 0.508: IC2.13 49.09,30.78 52,27.86 52,21.5 53.12,20.38 X1.3
OC3
  Top 0.508: IC2.14 49.45,32.05 54.92,26.58 X1.4
OC4
  Top 0.508: IC2.15 50.14,33.32 52.92,30.54 X1.5
OC5
  Top 0.508: IC2.16 50.39,34.59 51.42,35.62 X1.6
OC6
  Top 0.508: IC2.17 49.86,35.86 52,38 52,40 52.7,40.7 X1.7
OC7
  Top 0.508: IC2.18 49.63,37.13 51,38.5 51,44 52.78,45.78 X1.8
REF  (via drill 0.35)
  Top 0.152: v40,4 39.46,4.54 IC3.4
  Bottom 0.152: R43.1 R38.2 37.05,4 v40,4
REG_PD  (via drill 0.35)
  Top 0.152: v39,11 39,9.56 IC3.5
  Bottom 0.152: JP2.8 36.46,17.04 39,14.5 v39,11
SCL  (via drill 0.35)
  Top 0.152: 35.47,43 35.47,40.18 35.09,39.8 34.37,39.8 27.57,33.01 27.57,23.63 27.09,23.15 IC1.12 | K2.2 35.47,43 | 35.47,43 35.47,49.53 35,50 v35,52.5
  Bottom 0.152: K3.2 K2.2 | K1.5 14.72,52.5 v35,52.5
SDA  (via drill 0.35)
  Top 0.152: IC1.13 28.65,21.88 29,22.23 29,33 34.5,38.5 35.5,38.5 37.1,40.1 37.1,45 | K3.3 37.1,45 | 37.1,45 37.1,49.6 37.5,50 v37.5,55
  Bottom 0.152: K2.3 K3.3 | K1.3 12,52.32 12,54.5 12.5,55 v37.5,55

### Text on the board
tNames: GPIO Ctrl | INTB INTA RESETN | I2C Extender / / GND SCL SDA 3V3 | Inputs | Outputs | Inputs | Outputs | Channels / / ->0 6-> / ->1 5-> / ->2 2-> / ->3 4-> / ->4 3-> / ->5 2-> / ->6 1-> / ->7 0-> | Settings | A2 A1 A0 5V0 / PD | RPi HA 8ch in/out | +24V | GND